# EAGLE design chemsense (EAGLE 9.5.2)
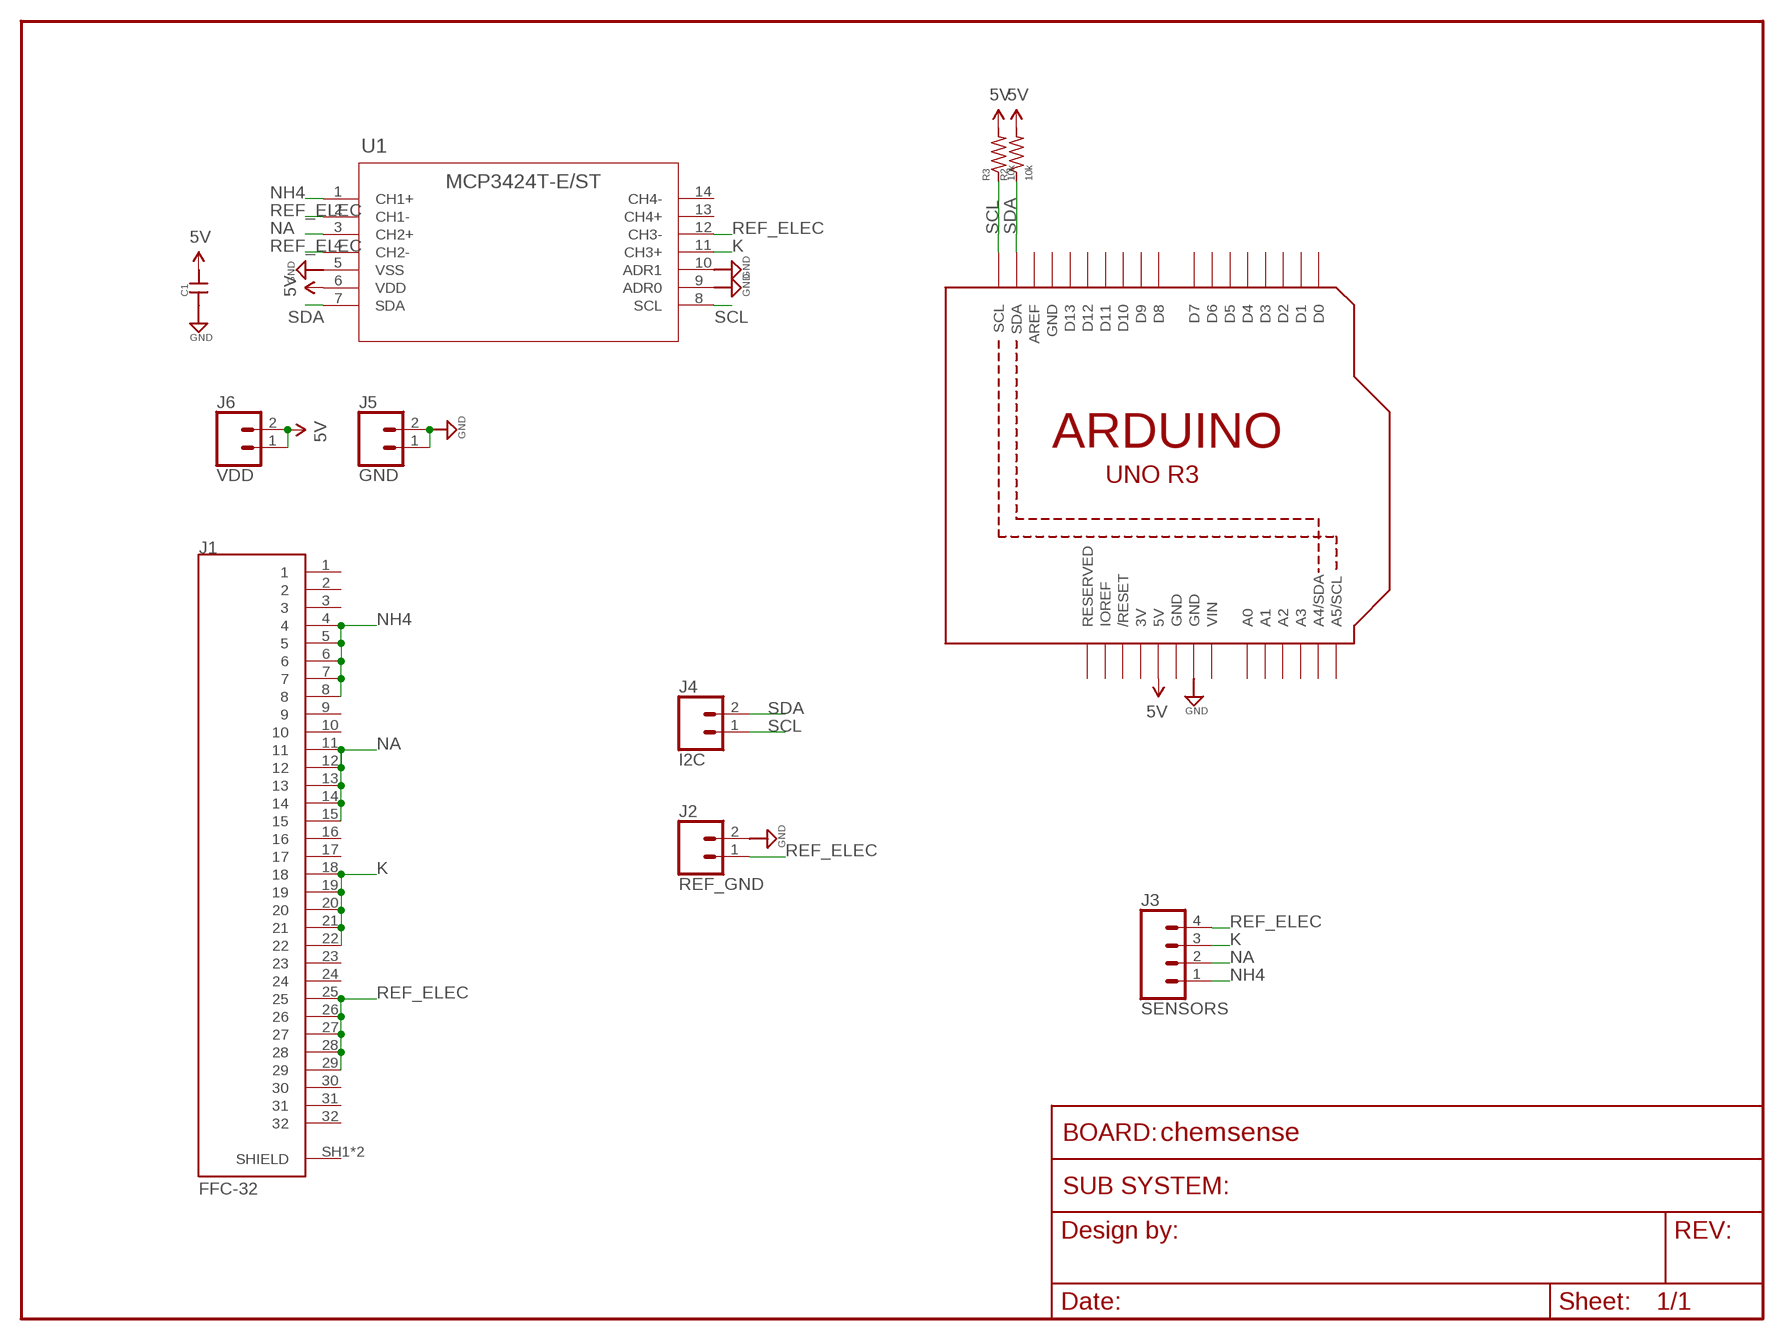
[diagram p0: schematic, sheet 1]

## Parts
C1  CAP0603-CAP  [0603-CAP]
J1  FFC-32  [MOLEX_503480-3200]
J2  REF_GND  CONN_02  [1X02]
J3  SENSORS  CONN_04  [1X04]
J4  I2C  CONN_02  [1X02]
J5  GND  CONN_02  [1X02]
J6  VDD  CONN_02  [1X02]
M1  ARDUINO_R3_ICSP  [ARDUINOR3_ICSP]
R2  10k  R-US_0603  [0603-RES]
R3  10k  R-US_0603  [0603-RES]
U1  MCP3424T-E/ST  [TSSOP14_MC]

## Nets
5V: C1.2 J6.1 J6.2 M1.5V R2.2 R3.2 U1.6(VDD)
GND: C1.1 J2.2 J5.1 J5.2 M1.GND@2(GND) U1.5(VSS) U1.9(ADR0) U1.10(ADR1)
K: J1.18 J1.19 J1.20 J1.21 J1.22 J3.3 U1.11(CH3+)
NA: J1.11 J1.12 J1.13 J1.14 J1.15 J3.2 U1.3(CH2+)
NH4: J1.4 J1.5 J1.6 J1.7 J1.8 J3.1 U1.1(CH1+)
REF_ELEC: J1.25 J1.26 J1.27 J1.28 J1.29 J2.1 J3.4 U1.2(CH1-) U1.4(CH2-) U1.12(CH3-)
SCL: J4.1 M1.SCL R3.1 U1.8(SCL)
SDA: J4.2 M1.SDA R2.1 U1.7(SDA)
Unconnected: J1.1 J1.2 J1.3 J1.9 J1.10 J1.16 J1.17 J1.23 J1.24 J1.30 J1.31 J1.32 J1.SH1(SHIELD) J1.SH2(SHIELD) M1.A0 M1.A1 M1.A2 M1.A3 M1.A4(A4/SDA) M1.A5(A5/SCL) M1.AREF M1.D0 M1.D1 M1.D2 M1.D3 M1.D4 M1.D5 M1.D6 M1.D7 M1.D8 M1.D9 M1.D10 M1.D11 M1.D12 M1.D13 M1.IOREF M1.RESERVED M1.RESET(/RESET) U1.13(CH4+) U1.14(CH4-)

## Power pins joined to a net without a drawn wire
3V: M1.3V
GND: M1.GND M1.GND@1(GND)
VIN: M1.VIN

## Library data of the parts
C1 = scono:CAP: Capacitor Standard 0603 ceramic capacitor, and 0.1" leaded capacitor.; PIE-INT-REF-NUM: CAPACITOR-GENERIC
J1 = scono:FFC-32: 0.50mm Pitch Easy-On™ BackFlip™ Type FPC Connector, 1.00mm Height, Right Angle, SMT, Dual Contact Style, 32 Circuits; DESCRIPTION: 0.50mm Pitch Easy-On™ BackFlip™ Type FPC Connector, 1.00mm Height, Right Angle, Surface Mount, Dual Contact Style, 32...; DIGI-KEY_PART_NUMBER: WM11115CT-ND; DIGI-KEY_PURCHASE_URL: https://www.digikey.com/product-detail/en/molex/5034803200/WM11115CT-ND/5171273?utm_source=snapeda&utm_medium=aggregator&utm_campaign=symbol; MF: Molex; MP: 5034803200; PACKAGE: None
J2 J4-J6 = scono:CONN_02: Multi connection point. Often used as Generic Header-pin footprint for 0.1 inch spaced/style header connections On any of the 0.1 inch spaced packages, you can populate with these: Break Away Headers - Straight <https://www.sparkfun.com/products/116> (PRT-00116) Break Away Male Headers - Right Angle <https://www.sparkfun.com/products/553> (PRT-00553) Female Headers <https://www.sparkfun.com/products/115> (PRT-00115) Break Away Headers - Machine Pin <https://www.sparkfun.com/products/117> (PRT-00117) Break Away Female Headers - Swiss Machine Pin <https://www.sparkfun.com/products/743> (PRT-00743) For SCREWTERMINALS and SPRING TERMINALS visit here: Screw Terimnals on SparkFun.com <https://www.sparkfun.com/search/results?term=Screw+Terminals> (5mm/3.5mm/2.54mm spacing) This device is also useful as a general connection point to wire up your design to another part of your project. Our various solder wires solder well into these plated through hole pads. Hook-Up Wire - Assortment (Stranded, 22 AWG) <https://www.sparkfun.com/products/11375> (PRT-11375) Hook-Up Wire - Assortment (Solid Core, 22 AWG) <https://www.sparkfun.com/products/11367> (PRT-11367) View the entire wire category on our website here <https://www.sparkfun.com/categories/141> Special notes: Molex polarized connector foot print use with: PRT-08233 with associated crimp pins and housings. 2.54_SCREWTERM for use with PRT-10571. 3.5mm Screw Terminal footprints for PRT-08084 5mm Screw Terminal footprints for use with PRT-08432
J3 = scono:CONN_04: Multi connection point. Often used as Generic Header-pin footprint for 0.1 inch spaced/style header connections On any of the 0.1 inch spaced packages, you can populate with these: Break Away Headers - Straight <https://www.sparkfun.com/products/116> (PRT-00116) Break Away Male Headers - Right Angle <https://www.sparkfun.com/products/553> (PRT-00553) Female Headers <https://www.sparkfun.com/products/115> (PRT-00115) Break Away Headers - Machine Pin <https://www.sparkfun.com/products/117> (PRT-00117) Break Away Female Headers - Swiss Machine Pin <https://www.sparkfun.com/products/743> (PRT-00743) For SCREWTERMINALS and SPRING TERMINALS visit here: Screw Terimnals on SparkFun.com <https://www.sparkfun.com/search/results?term=Screw+Terminals> (5mm/3.5mm/2.54mm spacing) This device is also useful as a general connection point to wire up your design to another part of your project. Our various solder wires solder well into these plated through hole pads. Hook-Up Wire - Assortment (Stranded, 22 AWG) <https://www.sparkfun.com/products/11375> (PRT-11375) Hook-Up Wire - Assortment (Solid Core, 22 AWG) <https://www.sparkfun.com/products/11367> (PRT-11367) View the entire wire category on our website here <https://www.sparkfun.com/categories/141> Special notes: Molex polarized connector foot print use with SKU : PRT-08231 with associated crimp pins and housings. 1MM SMD Version SKU: PRT-10208; PROD_ID: CONN-09696
M1 = scono:ARDUINO_R3_ICSP
R2 R3 = scono:R-US_: RESISTOR, American symbol
U1 = scono:MCP3424T-E/ST; MANUFACTURER_PART_NUMBER: MCP3424TEST; VENDOR: Microchip

## Board
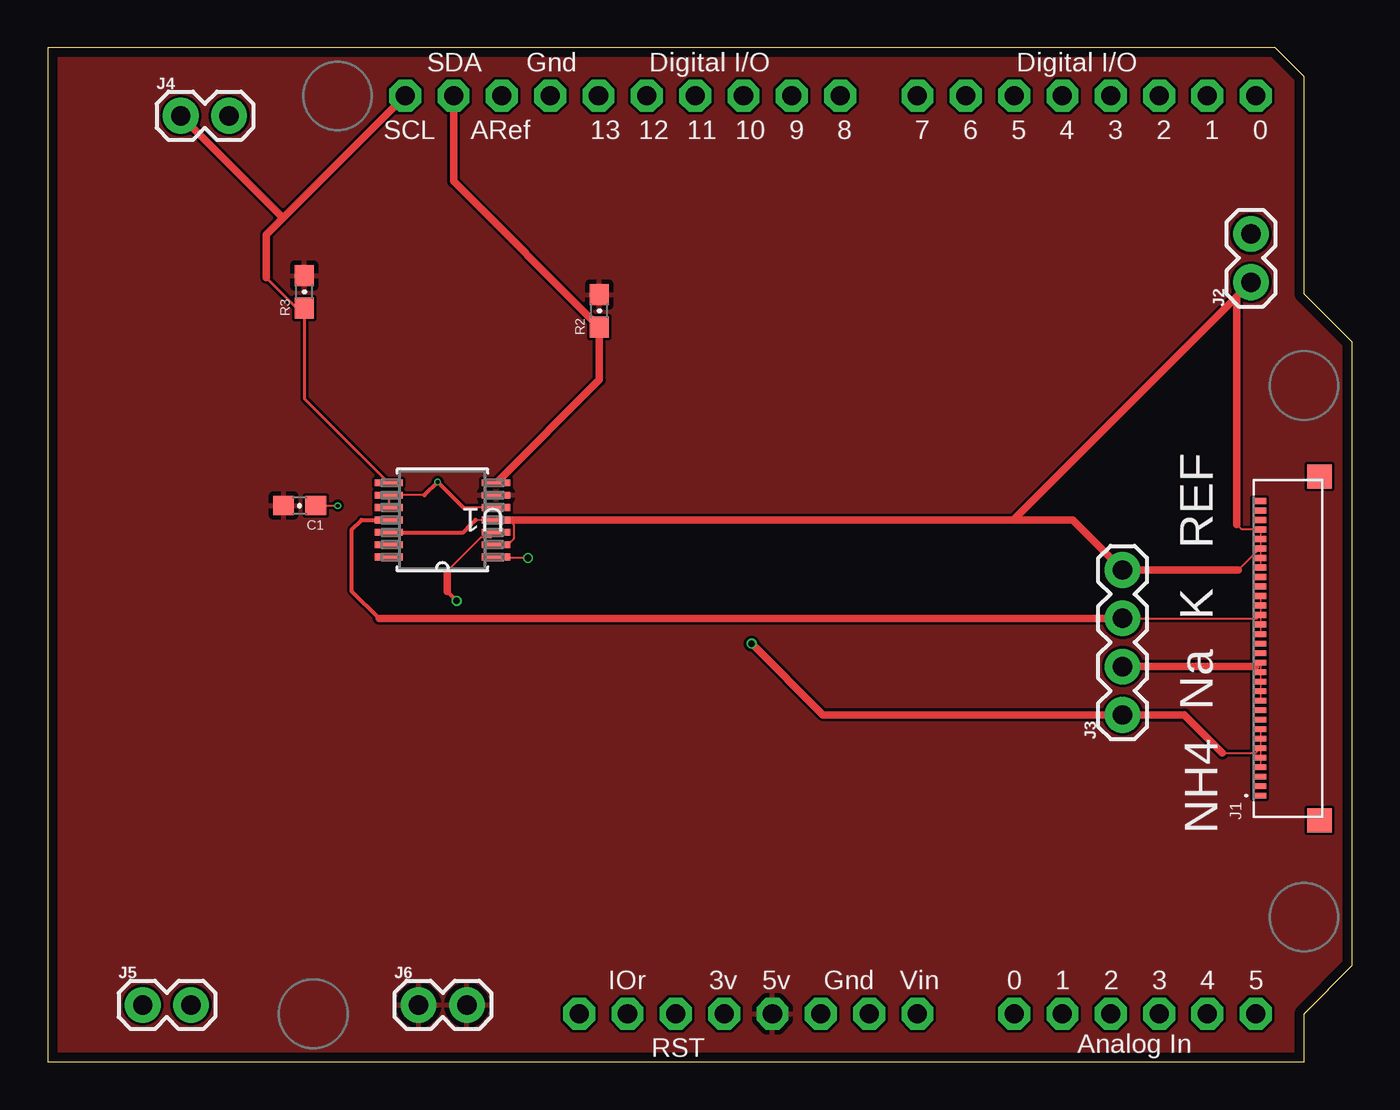
[diagram p1: board, top side]
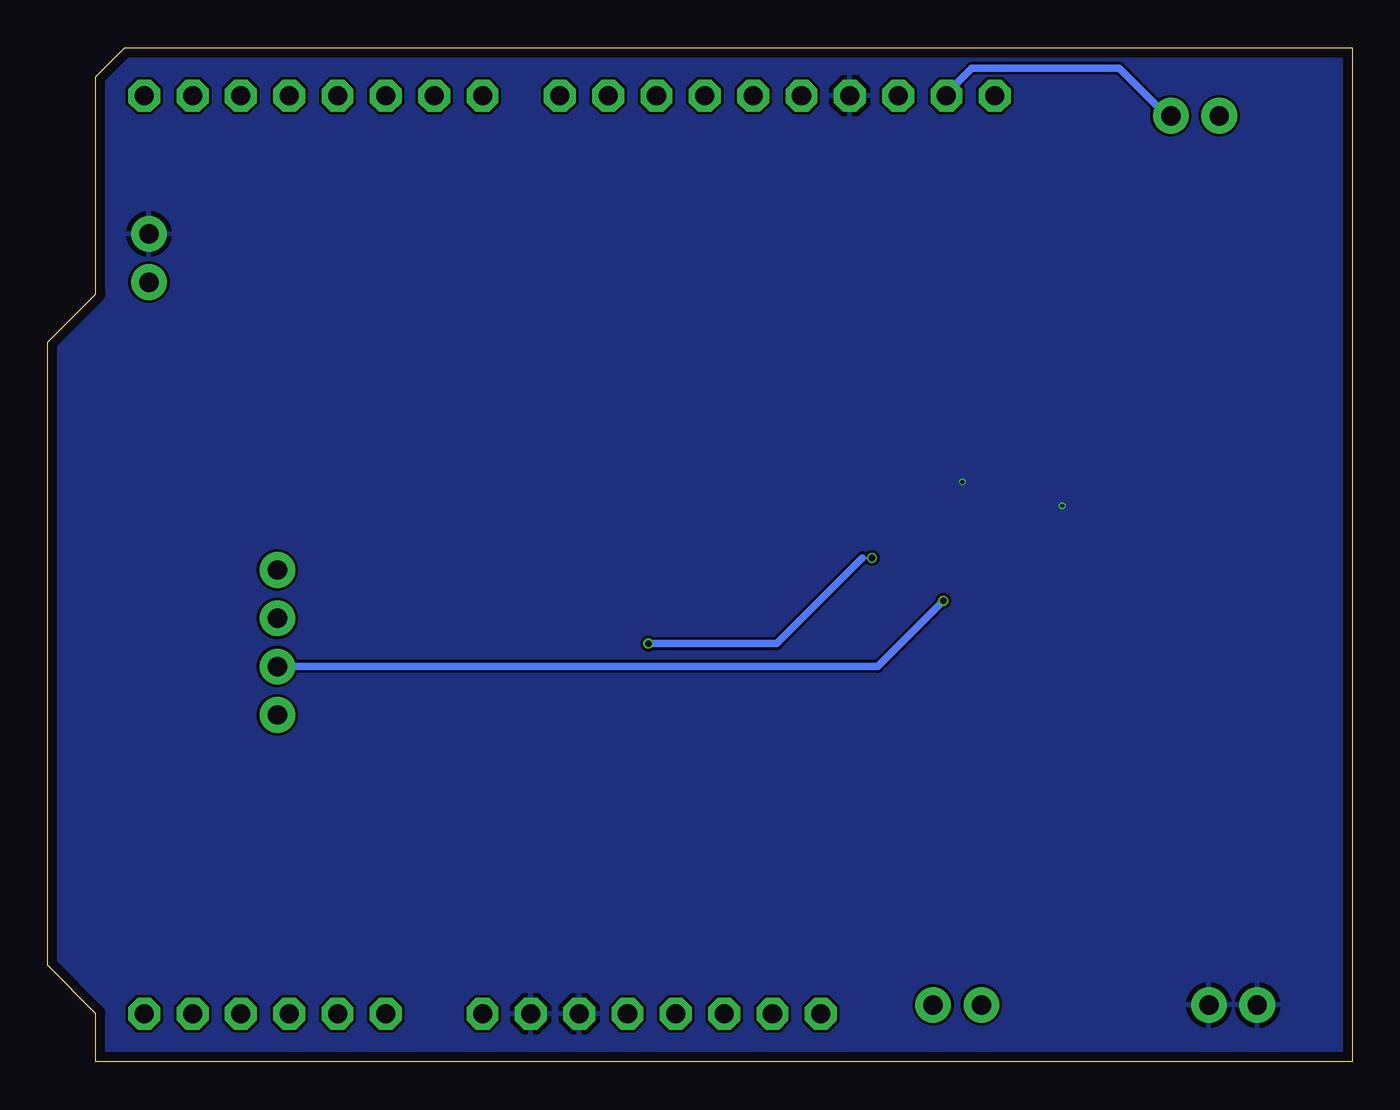
[diagram p2: board, bottom side, seen from below]

Size 68.58 x 53.34 mm. Coordinates in mm from the lower left corner, seen from the top.
Copper layers (1*16): Top 2mil / dielectric 9mil / Bottom 2mil
Design rules "scono": minimum track width 3.5mil, minimum drill 0.2mm, track to track 5.5mil, track to pad 5.5mil, pad to pad 5.5mil, via to via 5.5mil, smd to smd 0mil, copper to edge 0.5mm, drill to drill 0.5mm, minimum pad ring 3mil, minimum via ring 3mil, stop-mask expansion 3mil, vias tented up to drill 0mil, thermal gap 10mil

### Footprints (pad centres in the part's own frame; a part is rotated, then mirrored left to right if it is on the bottom)
0603-CAP = smd 1.1 x 1: 1 -0.85,0; 2 0.85,0
MOLEX_503480-3200 = smd 0.3 x 0.7: 1 -7.75,1.8; 2 -7.25,1.8; 3 -6.75,1.8; 4 -6.25,1.8; 5 -5.75,1.8; 6 -5.25,1.8; 7 -4.75,1.8; 8 -4.25,1.8; 9 -3.75,1.8; 10 -3.25,1.8; 11 -2.75,1.8; 12 -2.25,1.8; 13 -1.75,1.8; 14 -1.25,1.8; 15 -0.75,1.8; 16 -0.25,1.8; 17 0.25,1.8; 18 0.75,1.8; 19 1.25,1.8; 20 1.75,1.8; 21 2.25,1.8; 22 2.75,1.8; 23 3.25,1.8; 24 3.75,1.8; 25 4.25,1.8; 26 4.75,1.8; 27 5.25,1.8; 28 5.75,1.8; 29 6.25,1.8; 30 6.75,1.8; 31 7.25,1.8; 32 7.75,1.8 | smd 1.27 x 1.27: SH1 -9.04,-1.35; SH2 9.04,-1.35
1X02 = drill 1.016 pad 1.88: 1 0,0; 2 2.54,0
1X04 = drill 1.016 pad 1.88: 1 0,0; 2 2.54,0; 3 5.08,0; 4 7.62,0
ARDUINOR3_ICSP = drill 1 pad 1.676 octagon: 3V 35.56,2.54; 5V 38.1,2.54; A0 50.8,2.54; A1 53.34,2.54; A2 55.88,2.54; A3 58.42,2.54; A4 60.96,2.54; A5 63.5,2.54; AREF 23.876,50.8; D0 63.5,50.8; D1 60.96,50.8; D2 58.42,50.8; D3 55.88,50.8; D4 53.34,50.8; D5 50.8,50.8; D6 48.26,50.8; D7 45.72,50.8; D8 41.656,50.8; D9 39.116,50.8; D10 36.576,50.8; D11 34.036,50.8; D12 31.496,50.8; D13 28.956,50.8; GND 26.416,50.8; GND@1 43.18,2.54; GND@2 40.64,2.54; IOREF 30.48,2.54; RESERVED 27.94,2.54; RESET 33.02,2.54; SCL 18.796,50.8; SDA 21.336,50.8; VIN 45.72,2.54
0603-RES = smd 1.1 x 1: 1 -0.85,0; 2 0.85,0
TSSOP14_MC = smd 1.473 x 0.356: 1 -2.819,1.95; 2 -2.819,1.3; 3 -2.819,0.65; 4 -2.819,0; 5 -2.819,-0.65; 6 -2.819,-1.3; 7 -2.819,-1.95; 8 2.819,-1.95; 9 2.819,-1.3; 10 2.819,-0.65; 11 2.819,0; 12 2.819,0.65; 13 2.819,1.3; 14 2.819,1.95

### Placement (x,y rotation side)
C1  13.25,29.25 180 top
J1  65.5,21.75 90 top
J2  63.25,41 90 top
J3  56.5,18.25 90 top
J4  7,49.75 0 top
J5  5,3 0 top
J6  19.5,3 0 top
M1  0,0 0 top
R2  29,39.5 90 top
R3  13.5,40.5 90 top
U1  20.75,28.5 180 top

### Tracks (layer width: path | path; a pad name or v marks a point on that pad's centre or on a via)
5V
  pour Top: -3,56.25 71.25,56.25 71.25,-1.25 -3,-1.25
GND  (via drill 0.2)
  Top 0.1: U1.5 21.85,29.15 | 19.8,29.8 U1.9 U1.10 | C1.1 v15.25,29.25
  Top 0.2: 21.85,29.15 v20.5,30.5 19.8,29.8
  pour Bottom: -3,56.25 71.25,56.25 71.25,-1.25 -3,-1.25
K
  Top 0.089: 63.75,23 63.75,22.5 J1.18 | 63.75,23 J1.19 63.75,23 | 63.75,24 63.75,23.5 | 63.75,23.5 J1.20 63.75,23.5 | 63.75,24 J1.21 63.75,24 | 63.75,24 63.75,24.5 J1.22 | 63.75,23.5 63.75,23
  Top 0.1: J3.3 63.58,23.33 63.75,23.5
  Top 0.2: 17.42,23.33 16,24.75 16,28 16.5,28.5 U1.11
  Top 0.4: J3.3 17.42,23.33
NA  (via drill 0.35)
  Top 0.089: 63.75,19.5 63.75,19 J1.11 | 63.75,19.5 J1.12 63.75,19.5 | 63.75,20.5 63.75,20 | 63.75,20 J1.13 63.75,20 | 63.75,20.5 J1.14 63.75,20.5 | 63.75,20.5 63.75,21 J1.15 | 63.75,20 63.75,19.5
  Top 0.1: U1.3 23.29,27.57 22.75,27.57 21,25.81 | J1.15 63.49,20.79
  Top 0.2: 21,24.75 v21.5,24.25
  Top 0.4: 21,25.81 21,24.75 | 63.49,20.79 J3.2
  Bottom 0.4: v21.5,24.25 24.96,20.79 J3.2
NH4  (via drill 0.35)
  Top 0.089: 63.75,16 63.75,15.5 J1.4 | 63.75,16 J1.5 63.75,16 | 63.75,17 63.75,16.5 | 63.75,16.5 J1.6 63.75,16.5 | 63.75,17 J1.7 63.75,17 | 63.75,17 63.75,17.5 J1.8 | 63.75,16.5 63.75,16
  Top 0.1: v25.25,26.5 23.62,26.5 U1.1 | 61.75,16.25 63.5,16.25 63.75,16.5
  Top 0.4: v37,22 40.75,18.25 J3.1 59.75,18.25 61.75,16.25
  Bottom 0.1: 25.75,26.5 v25.25,26.5
  Bottom 0.4: v37,22 30.25,22 25.75,26.5
REF_ELEC
  Top 0.089: 24.25,28.5 24.5,28.25 | 24.25,28.5 23.75,28.5 U1.4 | 22.5,28.5 23.5,28.5 U1.4 | 24.25,28.5 U1.4 | 63.75,26.5 63.75,26 J1.25 | 63.75,26.5 J1.26 63.75,26.5 | 63.75,27.5 63.75,27 | 63.75,27 J1.27 63.75,27 | 63.75,27.5 J1.28 63.75,27.5 | 63.75,27.5 63.75,28 J1.29 | 63.75,27 63.75,26.5
  Top 0.1: 24.5,28.25 24.5,27.5 24.2,27.2 U1.2 | J1.29 62.75,28 62.5,28.25 | 62.5,40.25 J2.1 | 62.57,25.87 J1.27
  Top 0.2: 22.5,28.5 22.25,28.25 21.85,27.85 U1.12
  Top 0.4: 50.75,28.5 J2.1 | 24.25,28.5 50.75,28.5 | 62.5,28.25 62.5,40.25 | 62.57,25.87 J3.4 53.87,28.5 50.75,28.5
SCL
  Top 0.089: 12.25,44.5 12.25,44.25
  Top 0.152: 11.5,41.25 13.1,39.65 R3.1 13.5,34.88 U1.8
  Top 0.4: M1.SCL 12.25,44.25 11.5,43.5 11.5,41.25 | 12.25,44.5 J4.1
SDA
  Top 0.4: U1.7 29,35.88 R2.1 21.34,46.31 M1.SDA
  Bottom 0.089: 9.75,49.75 J4.2
  Bottom 0.1: 21.34,50.91 M1.SDA
  Bottom 0.4: 9.75,49.75 12.25,52.25 20,52.25 21.34,50.91

### Text on the board
tPlace: REF | K | Na | NH4